# Altium schematic sheet zs-pentagon-dip_3.SchDoc
size A4
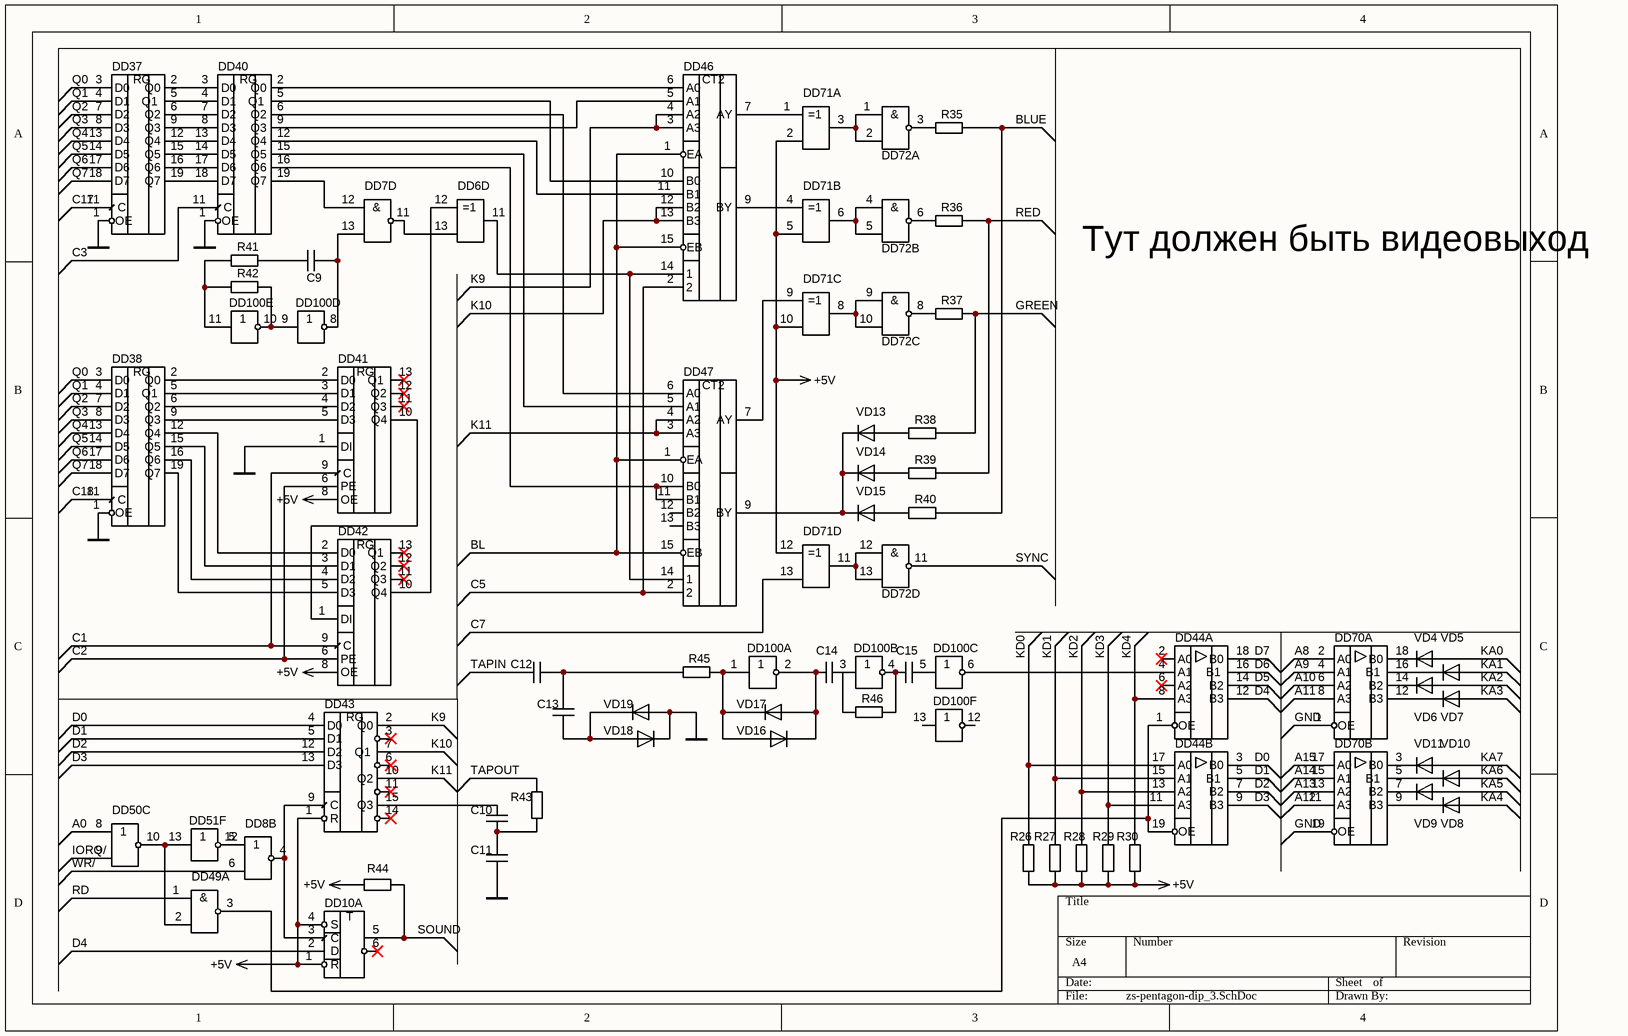
[diagram p0: zs-pentagon-dip_3.SchDoc]

## Parts
C9  0.47 мкФ  [C0805]  (value not drawn)
C10  0.22 мкФ  [C0805]  (value not drawn)
C11  0.1 мкФ  [C0805]  (value not drawn)
C12  1 мкФ  [C0805]  (value not drawn)
C13  10 мкФ  [C0805]  (value not drawn)
C14  1 мкФ  [C0805]  (value not drawn)
C15  1 мкФ  [C0805]  (value not drawn)
DD6  КР1533ЛП5  [DIP14]  (value not drawn)  (part D of 4)
DD7  КР1533ЛA3  [DIP14]  (value not drawn)  (part D of 4)
DD8  КР1533ЛЕ1  [DIP14]  (value not drawn)  (part B of 4)
DD10  КР1533ТМ2  [DIP14]  (value not drawn)  (part A of 2)
DD37  КР1533ИР23  [DIP20]  (value not drawn)
DD38  КР1533ИР23  [DIP20]  (value not drawn)
DD40  КР1533ИР23  [DIP20]  (value not drawn)
DD41  К555ИР16  [DIP14]  (value not drawn)
DD42  К555ИР16  [DIP14]  (value not drawn)
DD43  КР1533ТМ8  [DIP16]  (value not drawn)
DD44  КР1533АП5  [DIP20]  (value not drawn)  (parts A,B of 2)
DD46  КР1533КП2  [DIP16]  (value not drawn)
DD47  КР1533КП2  [DIP16]  (value not drawn)
DD49  КР1533ЛA3  [DIP14]  (value not drawn)  (part A of 4)
DD50  КР1533ЛЕ1  [DIP14]  (value not drawn)  (part C of 4)
DD51  КР1533ЛН1  [DIP14]  (value not drawn)  (part F of 6)
DD70  КР1533АП5  [DIP20]  (value not drawn)  (parts A,B of 2)
DD71  КР1533ЛП5  [DIP14]  (value not drawn)  (parts A,B,C,D of 4)
DD72  К155ЛA12  [DIP14]  (value not drawn)  (parts A,B,C,D of 4)
DD100  К561ЛН2  [DIP14]  (value not drawn)  (parts A,B,C,D,E,F of 6)
R26  10 кОм  [R0603]  (value not drawn)  (no BOM)
R27  10 кОм  [R0603]  (value not drawn)  (no BOM)
R28  10 кОм  [R0603]  (value not drawn)  (no BOM)
R29  10 кОм  [R0603]  (value not drawn)  (no BOM)
R30  10 кОм  [R0603]  (value not drawn)  (no BOM)
R35  68 Ом  [R0603]  (value not drawn)  (no BOM)
R36  68 Ом  [R0603]  (value not drawn)  (no BOM)
R37  68 Ом  [R0603]  (value not drawn)  (no BOM)
R38  68 Ом  [R0603]  (value not drawn)  (no BOM)
R39  68 Ом  [R0603]  (value not drawn)  (no BOM)
R40  68 Ом  [R0603]  (value not drawn)  (no BOM)
R41  1 МОм  [R0603]  (value not drawn)  (no BOM)
R42  1 МОм  [R0603]  (value not drawn)  (no BOM)
R43  10 кОм  [R0603]  (value not drawn)  (no BOM)
R44  430 Ом  [R0603]  (value not drawn)  (no BOM)
R45  620 Ом  [R0603]  (value not drawn)  (no BOM)
R46  100 кОм  [R0603]  (value not drawn)  (no BOM)
VD4  1N4148W  [SODFL1608X70N]  (value not drawn)
VD5  1N4148W  [SODFL1608X70N]  (value not drawn)
VD6  1N4148W  [SODFL1608X70N]  (value not drawn)
VD7  1N4148W  [SODFL1608X70N]  (value not drawn)
VD8  1N4148W  [SODFL1608X70N]  (value not drawn)
VD9  1N4148W  [SODFL1608X70N]  (value not drawn)
VD10  1N4148W  [SODFL1608X70N]  (value not drawn)
VD11  1N4148W  [SODFL1608X70N]  (value not drawn)
VD13  1N4148W  [SODFL1608X70N]  (value not drawn)
VD14  1N4148W  [SODFL1608X70N]  (value not drawn)
VD15  1N4148W  [SODFL1608X70N]  (value not drawn)
VD16  1N4148W  [SODFL1608X70N]  (value not drawn)
VD17  1N4148W  [SODFL1608X70N]  (value not drawn)
VD18  1N4148W  [SODFL1608X70N]  (value not drawn)
VD19  1N4148W  [SODFL1608X70N]  (value not drawn)

## Nets
+5V: DD10.1(R) DD10.4(S) DD41.8(OE) DD42.8(OE) DD43.1(R) DD71.2 DD71.5 DD71.10 DD71.12 R26.2 R27.2 R28.2 R29.2 R30.2 R44.1
GND: C11.2 DD10.7(GND) DD37.1(OE) DD37.10(GND) DD38.1(OE) DD38.10(GND) DD40.1(OE) DD40.10(GND) DD41.1(DI) DD41.7(GND) DD42.7(GND) DD43.8(GND) DD44.10(GND) DD46.8(GND) DD47.8(GND) DD49.7(GND) DD70.1(OE) DD70.10(GND) DD70.19(OE) DD71.7(GND) DD72.7(GND) DD100.7(GND) VD18.C VD19.A
VCC: DD10.14(VCC) DD37.20(VCC) DD38.20(VCC) DD40.20(VCC) DD41.14(VCC) DD42.14(VCC) DD43.16(VCC) DD44.20(VCC) DD46.16(VCC) DD47.16(VCC) DD49.14(VCC) DD70.20(VCC) DD71.14(VCC) DD72.14(VCC) DD100.14(VCC)
A0: DD50.8
A8: DD70.2(A0)
A9: DD70.4(A1)
A10: DD70.6(A2)
A11: DD70.8(A3)
A12: DD70.11(A3)
A13: DD70.13(A2)
A14: DD70.15(A1)
A15: DD70.17(A0)
BL: DD46.1(EA) DD46.15(EB) DD47.1(EA) DD47.15(EB)
BLUE: R35.1 R40.1
C1: DD41.9(C) DD42.9(C)
C2: DD41.6(PE) DD42.6(PE)
C3: DD40.11(C)
C5: DD46.2 DD47.2
C7: DD71.13
C17: DD37.11(C)
C18: DD38.11(C)
D0: DD43.4(D0) DD44.3(B0)
D1: DD43.5(D1) DD44.5(B1)
D2: DD43.12(D2) DD44.7(B2)
D3: DD43.13(D3) DD44.9(B3)
D4: DD10.2(D) DD44.12(B3)
D5: DD44.14(B2)
D6: DD44.16(B1)
D7: DD44.18(B0)
GREEN: R37.1 R38.1
IORQ/: DD50.9
K9: DD43.2(Q0) DD46.3(A3) DD46.4(A2)
K10: DD43.7(Q1) DD46.12(B2) DD46.13(B3)
K11: DD43.10(Q2) DD47.3(A3) DD47.4(A2)
KA0: VD4.A
KA1: VD5.A
KA2: VD6.A
KA3: VD7.A
KA4: VD8.A
KA5: VD9.A
KA6: VD10.A
KA7: VD11.A
KD0: DD44.17(A0) R26.1
KD1: DD44.15(A1) R27.1
KD2: DD44.13(A2) R28.1
KD3: DD44.11(A3) R29.1
KD4: DD44.8(A3) R30.1
Q0: DD37.3(D0) DD38.3(D0)
Q1: DD37.4(D1) DD38.4(D1)
Q2: DD37.7(D2) DD38.7(D2)
Q3: DD37.8(D3) DD38.8(D3)
Q4: DD37.13(D4) DD38.13(D4)
Q5: DD37.14(D5) DD38.14(D5)
Q6: DD37.17(D6) DD38.17(D6)
Q7: DD37.18(D7) DD38.18(D7)
RD: DD49.1
RED: R36.1 R39.1
SOUND: DD10.5 R44.2
SYNC: DD72.11
TAPIN: C12.1
TAPOUT: R43.1
WR/: DD8.6
NetC9_1: C9.1 DD7.13 DD100.8
NetC9_2: C9.2 R41.1
NetC10_1: C10.1 DD43.15(Q3)
NetC10_2: C10.2 C11.1 R43.2
NetC12_2: C12.2 C13.2 R45.2
NetC13_1: C13.1 VD18.A VD19.C
NetC14_1: C14.1 DD100.2 VD16.C VD17.A
NetC14_2: C14.2 DD100.3 R46.2
NetC15_1: C15.1 DD100.4 R46.1
NetC15_2: C15.2 DD100.5
NetDD6_11: DD6.11 DD46.14(1) DD47.14(1)
NetDD6_12: DD6.12 DD42.10(Q4)
NetDD6_13: DD6.13 DD7.11
NetDD7_12: DD7.12 DD40.19(Q7)
NetDD8_4: DD8.4 DD10.3(C) DD43.9(C)
NetDD8_5: DD8.5 DD51.12
NetDD37_2: DD37.2(Q0) DD40.3(D0)
NetDD37_5: DD37.5(Q1) DD40.4(D1)
NetDD37_6: DD37.6(Q2) DD40.7(D2)
NetDD37_9: DD37.9(Q3) DD40.8(D3)
NetDD37_12: DD37.12(Q4) DD40.13(D4)
NetDD37_15: DD37.15(Q5) DD40.14(D5)
NetDD37_16: DD37.16(Q6) DD40.17(D6)
NetDD37_19: DD37.19(Q7) DD40.18(D7)
NetDD38_2: DD38.2(Q0) DD41.2(D0)
NetDD38_5: DD38.5(Q1) DD41.3(D1)
NetDD38_6: DD38.6(Q2) DD41.4(D2)
NetDD38_9: DD38.9(Q3) DD41.5(D3)
NetDD38_12: DD38.12(Q4) DD42.2(D0)
NetDD38_15: DD38.15(Q5) DD42.3(D1)
NetDD38_16: DD38.16(Q6) DD42.4(D2)
NetDD38_19: DD38.19(Q7) DD42.5(D3)
NetDD40_2: DD40.2(Q0) DD46.6(A0)
NetDD40_5: DD40.5(Q1) DD46.10(B0)
NetDD40_6: DD40.6(Q2) DD47.6(A0)
NetDD40_9: DD40.9(Q3) DD46.5(A1)
NetDD40_12: DD40.12(Q4) DD46.11(B1)
NetDD40_15: DD40.15(Q5) DD47.5(A1)
NetDD40_16: DD40.16(Q6) DD47.10(B0) DD47.11(B1)
NetDD41_10: DD41.10(Q4) DD42.1(DI)
NetDD44_1: DD44.1(OE) DD44.19(OE) DD49.3
NetDD44_4: DD44.4(A1) DD100.6
NetDD46_7: DD46.7(AY) DD71.1
NetDD46_9: DD46.9(BY) DD71.4
NetDD47_7: DD47.7(AY) DD71.9
NetDD47_9: DD47.9(BY) VD13.C VD14.C VD15.C
NetDD49_2: DD49.2 DD50.10 DD51.13
NetDD70_3: DD70.3(B0) VD11.C
NetDD70_5: DD70.5(B1) VD10.C
NetDD70_7: DD70.7(B2) VD9.C
NetDD70_9: DD70.9(B3) VD8.C
NetDD70_12: DD70.12(B3) VD7.C
NetDD70_14: DD70.14(B2) VD6.C
NetDD70_16: DD70.16(B1) VD5.C
NetDD70_18: DD70.18(B0) VD4.C
NetDD71_3: DD71.3 DD72.1 DD72.2
NetDD71_6: DD71.6 DD72.4 DD72.5
NetDD71_8: DD71.8 DD72.9 DD72.10
NetDD71_11: DD71.11 DD72.12 DD72.13
NetDD72_3: DD72.3 R35.2
NetDD72_6: DD72.6 R36.2
NetDD72_8: DD72.8 R37.2
NetDD100_1: DD100.1 R45.1 VD16.A VD17.C
NetDD100_9: DD100.9 DD100.10 R42.1
NetDD100_11: DD100.11 R41.2 R42.2
NetR38_2: R38.2 VD13.A
NetR39_2: R39.2 VD14.A
NetR40_2: R40.2 VD15.A

Not connected (* = marked no-connect by the designer): DD10 6*; DD41 11(Q3)* 12(Q2)* 13(Q1)*; DD42 11(Q3)* 12(Q2)* 13(Q1)*; DD43 3* 6* 11* 14*; DD44 2(A0)* 6(A2)*; DD47 12(B2) 13(B3); DD100 12 13

## Notes on the sheet
- Тут должен быть видеовыход
- (in symbol К155ЛA12, part A) &
- (in symbol К155ЛA12, part B) &
- (in symbol К155ЛA12, part C) &
- (in symbol К155ЛA12, part D) &
- (in symbol К555ИР16) RG
- (in symbol КР1533ИР23) RG
- (in symbol КР1533КП2) CT2
- (in symbol КР1533ЛA3, part A) &
- (in symbol КР1533ЛA3, part D) &
- (in symbol КР1533ТМ2, part A) Т
- (in symbol КР1533ТМ8) RG

## Library data of the parts
C9-C15 = CapCer
R26-R30 R35-R46 = Res